# Altium schematic sheet e-VEREST.SchDoc
size A2; Author: Balint Cristian; DrawnBy: Balint Cristian; SheetNumber: 1; SheetTotal: 1
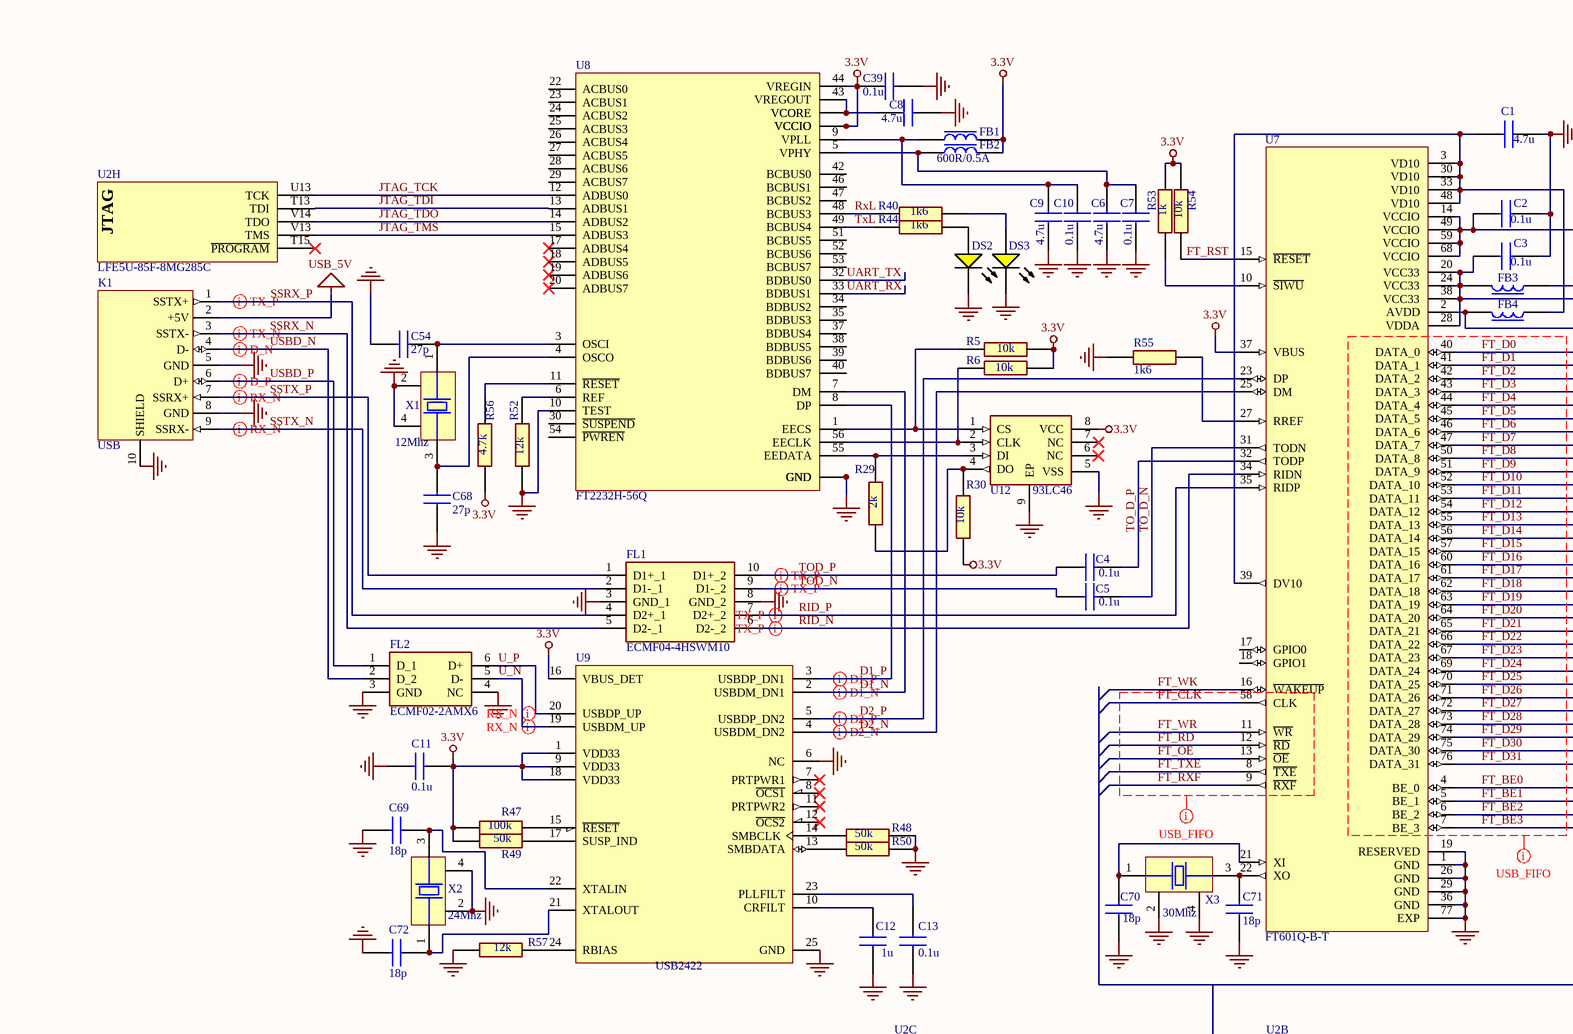
[diagram p0: e-VEREST.SchDoc, top left]
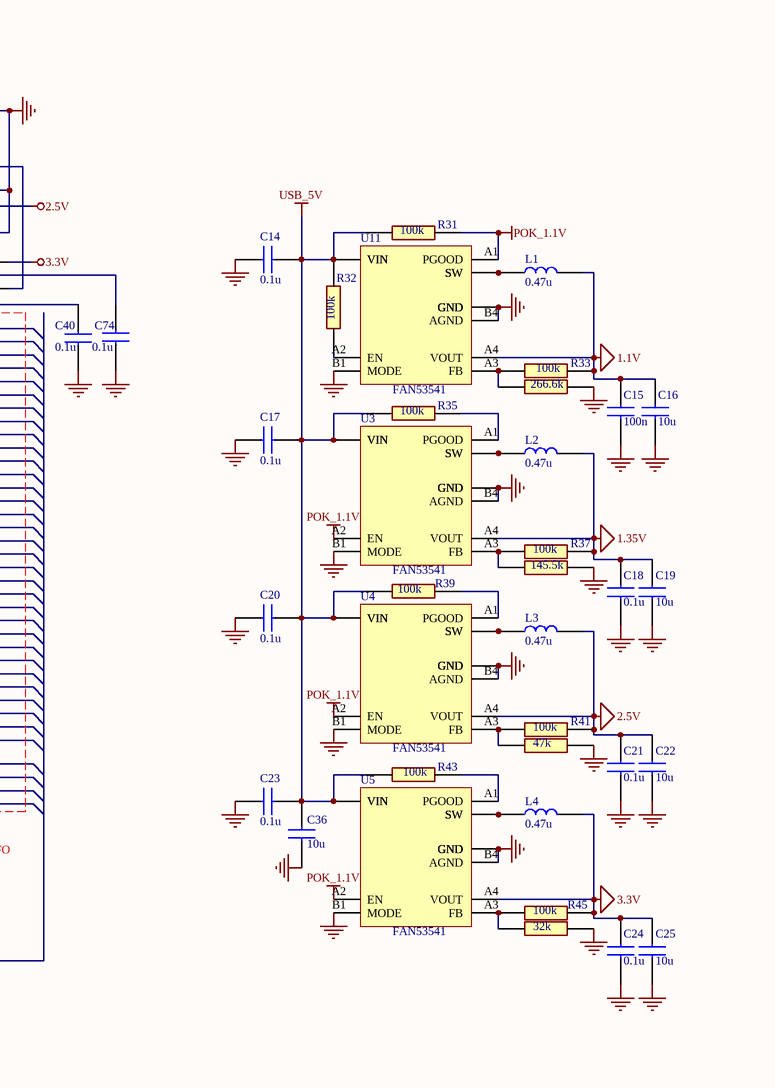
[diagram p1: e-VEREST.SchDoc, top right]
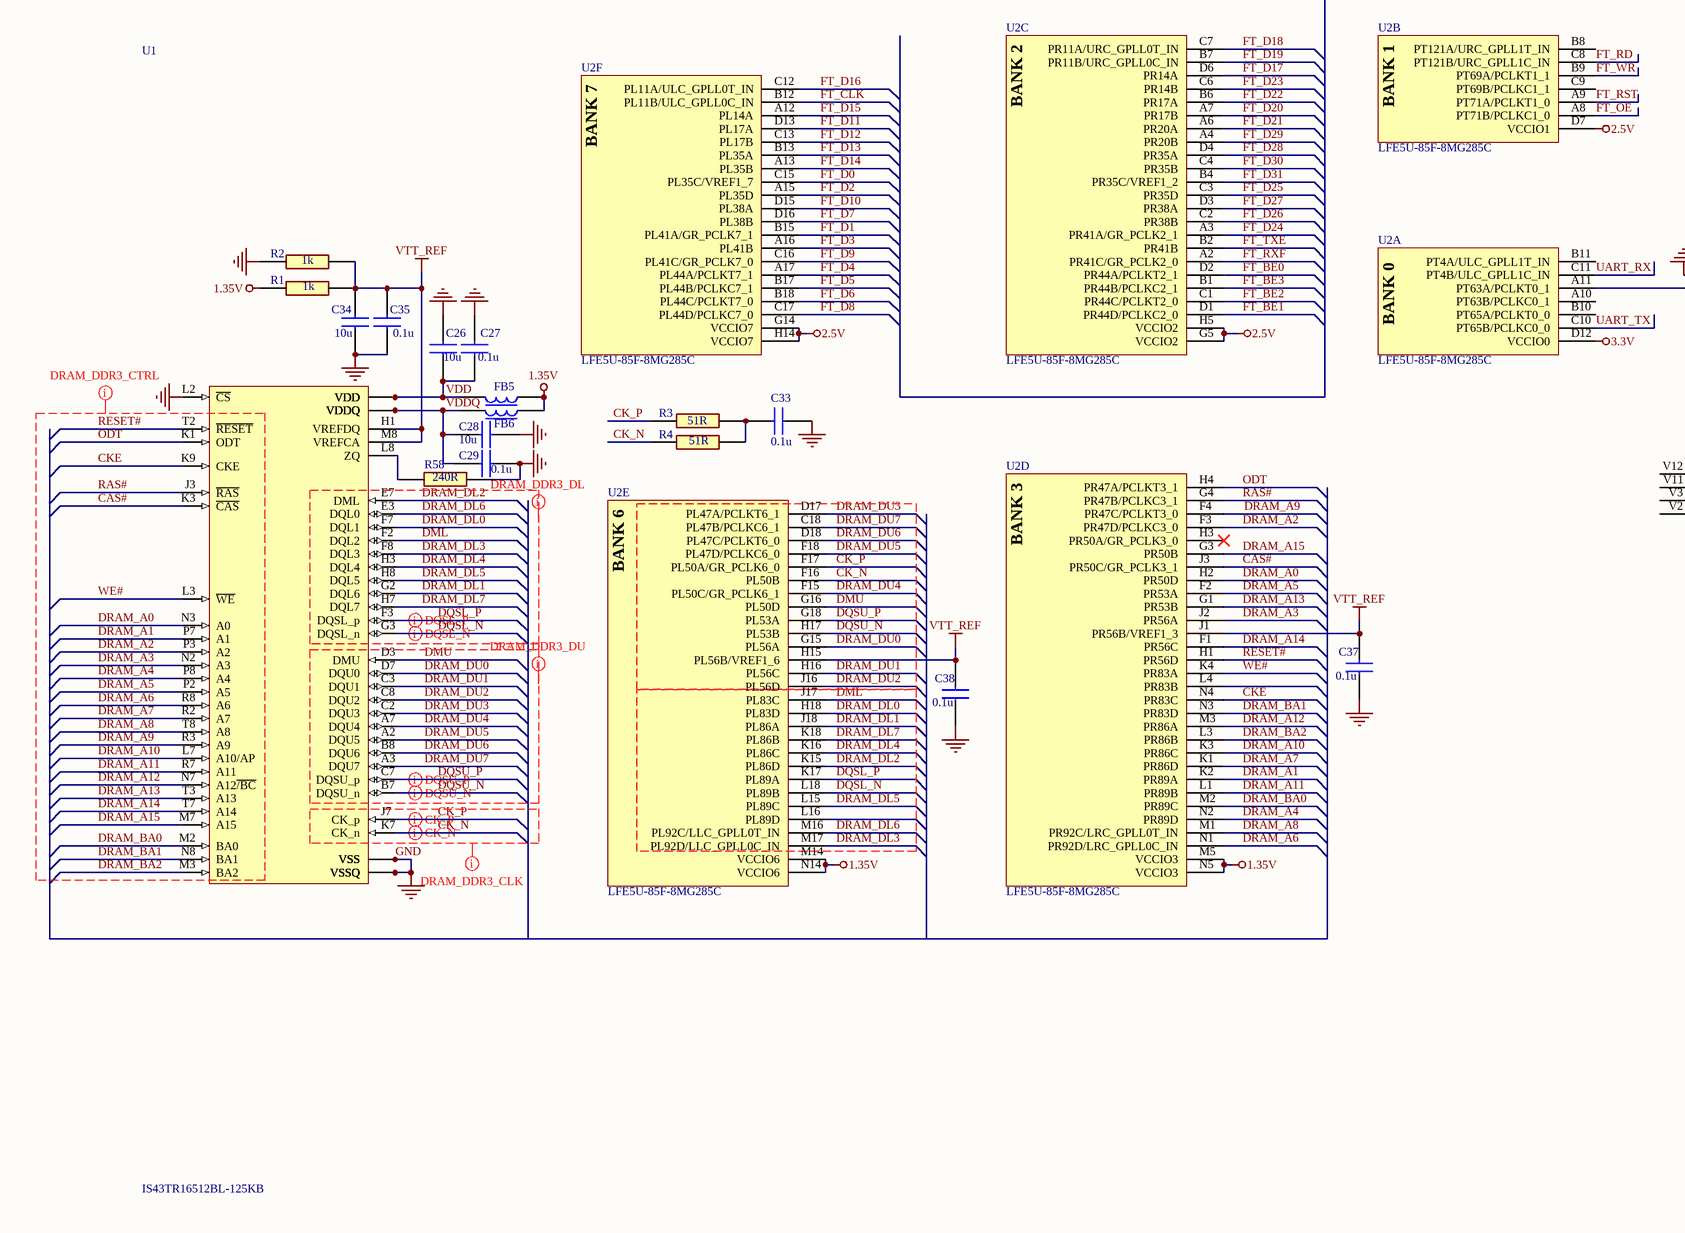
[diagram p2: e-VEREST.SchDoc, bottom left]
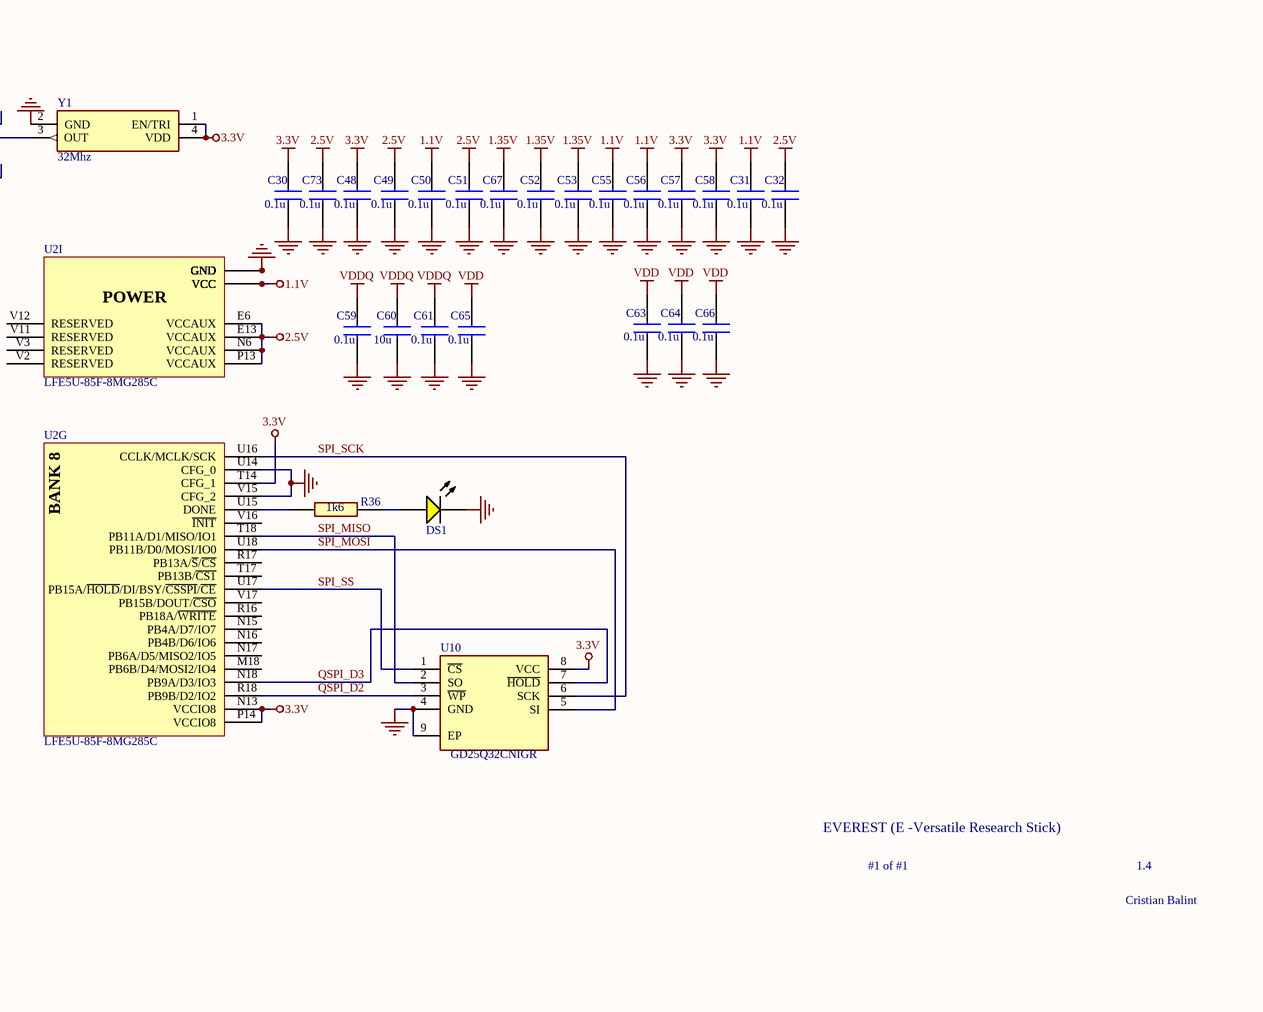
[diagram p3: e-VEREST.SchDoc, bottom right]

## Parts
C1  4.7u  [SMD0201]
C2  0.1u  [SMD0201]
C3  0.1u  [SMD0201]
C4  0.1u  [SMD0201]
C5  0.1u  [SMD0201]
C6  4.7u  [SMD0201]
C7  0.1u  [SMD0201]
C8  4.7u  [SMD0201]
C9  4.7u  [SMD0201]
C10  0.1u  [SMD0201]
C11  0.1u  [SMD0201]
C12  1u  [SMD0201]
C13  0.1u  [SMD0201]
C14  0.1u  [SMD0201]
C15  100n  [SMD0402]
C16  10u  [SMD0402]
C17  0.1u  [SMD0201]
C18  0.1u  [SMD0201]
C19  10u  [SMD0402]
C20  0.1u  [SMD0201]
C21  0.1u  [SMD0201]
C22  10u  [SMD0402]
C23  0.1u  [SMD0201]
C24  0.1u  [SMD0201]
C25  10u  [SMD0402]
C26  10u  [SMD0402]
C27  0.1u  [SMD0402]
C28  10u  [SMD0402]
C29  0.1u  [SMD0402]
C30  0.1u  [SMD0201]
C31  0.1u  [SMD0201]
C32  0.1u  [SMD0402]
C33  0.1u  [SMD0201]
C34  10u  [SMD0402]
C35  0.1u  [SMD0402]
C36  10u  [SMD0402]
C37  0.1u  [SMD0201]
C38  0.1u  [SMD0402]
C39  0.1u  [SMD0201]
C40  0.1u  [SMD0402]
C48  0.1u  [SMD0201]
C49  0.1u  [SMD0201]
C50  0.1u  [SMD0402]
C51  0.1u  [SMD0201]
C52  0.1u  [SMD0201]
C53  0.1u  [SMD0201]
C54  27p  [SMD0201]
C55  0.1u  [SMD0201]
C56  0.1u  [SMD0201]
C57  0.1u  [SMD0201]
C58  0.1u  [SMD0201]
C59  0.1u  [SMD0402]
C60  10u  [SMD0402]
C61  0.1u  [SMD0402]
C63  0.1u  [SMD0201]
C64  0.1u  [SMD0402]
C65  0.1u  [SMD0402]
C66  0.1u  [SMD0402]
C67  0.1u  [SMD0201]
C68  27p  [SMD0201]
C69  18p  [SMD0201]
C70  18p  [SMD0402]
C71  18p  [SMD0402]
C72  18p  [SMD0201]
C73  0.1u  [SMD0201]
C74  0.1u  [SMD0201]
DS1  LED 0603  [LED0603]  (value not drawn)
DS2  LED 0603  [LED0603]  (value not drawn)
DS3  LED 0603  [LED0603]  (value not drawn)
FB1  600R/0.5A  [SMD0402]  (value not drawn)
FB2  600R/0.5A  [SMD0402]
FB3  600R/0.5A  [SMD0402]  (value not drawn)
FB4  600R/0.5A  [SMD0402]  (value not drawn)
FB5  600R/0.5A  [SMD0402]  (value not drawn)
FB6  600R/0.5A  [SMD0402]  (value not drawn)
FL1  ECMF04-4HSWM10  [SON50P135X260X55-10N-D]
FL2  ECMF02-2AMX6  [SON50P150X170X55-6N-D]
K1  USB  [USB-TYPE-A-3.0]
L1  0.47u  [SMD0805]
L2  0.47u  [SMD0805]
L3  0.47u  [SMD0805]
L4  0.47u  [SMD0805]
R1  1k  [SMD0402]
R2  1k  [SMD0402]
R3  51R  [SMD0201]
R4  51R  [SMD0201]
R5  10k  [SMD0201]
R6  10k  [SMD0201]
R29  2k  [SMD0201]
R30  10k  [SMD0201]
R31  100k  [SMD0201]
R32  100k  [SMD0201]
R33  100k  [SMD0201]
R34  266.6k  [SMD0201]
R35  100k  [SMD0201]
R36  1k6  [SMD0201]
R37  100k  [SMD0201]
R38  145.5k  [SMD0201]
R39  100k  [SMD0201]
R40  1k6  [SMD0201]
R41  100k  [SMD0201]
R42  47k  [SMD0201]
R43  100k  [SMD0201]
R44  1k6  [SMD0201]
R45  100k  [SMD0201]
R46  32k  [SMD0201]
R47  100k  [SMD0201]
R48  50k  [SMD0201]
R49  50k  [SMD0201]
R50  50k  [SMD0201]
R52  12k  [SMD0201]
R53  1k  [SMD0201]
R54  10k  [SMD0201]
R55  1k6  [SMD0201]
R56  4.7k  [SMD0201]
R57  12k  [SMD0201]
R58  240R  [SMD0402]
U1  IS43TR16512BL-125KB  [*BGA96C80P9X16_1000X1400X140N_IS43TR16512AL-125KBL(Primary)]
U2  LFE5U-85F-8MG285C  [*BGA285N50P18X18_1000X1000X130]  (parts A,B,C,D,E,F,G,H,I of 9)
U3  FAN53541  [WLCSP20P4X5]
U4  FAN53541  [WLCSP20P4X5]
U5  FAN53541  [WLCSP20P4X5]
U7  FT601Q-B-T  [FT601Q]
U8  FT2232H-56Q  [QFN50P800X800X100-57N-D]
U9  USB2422  [QFN-MJ24]
U10  GD25Q32CNIGR  [*SON50P300X400X100-9N]
U11  FAN53541  [WLCSP20P4X5]
U12  93LC46  [*SON50P200X300X100-9N]
X1  12Mhz  [CRYSTAL2520]
X2  24Mhz  [CRYSTAL1210]
X3  30Mhz  [CRYSTAL1210]
Y1  32Mhz  [TY]

## Nets
1.1V: C15.2 C16.2 C31.1 C50.1 C55.1 C56.1 L1.2 R33.2 U2.D8(VCC) U2.D9(VCC) U2.D10(VCC) U2.D11(VCC) U2.J4(VCC) U2.J5(VCC) U2.J14(VCC) U2.J15(VCC) U2.M4(VCC) U2.M15(VCC) U2.P7(VCC) U2.P9(VCC) U2.P11(VCC) U11.A4(VOUT)
1.35V: C18.2 C19.2 C52.1 C53.1 C67.1 FB5.1 FB6.1 L2.2 R1.1 R37.2 U2.M5(VCCIO3) U2.M14(VCCIO6) U2.N5(VCCIO3) U2.N14(VCCIO6) U3.A4(VOUT)
2.5V: C2.2 C21.2 C22.2 C32.1 C49.1 C51.1 C73.1 L3.2 R41.2 U2.D7(VCCIO1) U2.E6(VCCAUX) U2.E13(VCCAUX) U2.G5(VCCIO2) U2.G14(VCCIO7) U2.H5(VCCIO2) U2.H14(VCCIO7) U2.N6(VCCAUX) U2.P13(VCCAUX) U4.A4(VOUT) U7.14(VCCIO) U7.49(VCCIO) U7.59(VCCIO) U7.68(VCCIO)
3.3V: C11.1 C24.2 C25.2 C30.1 C39.2 C48.1 C57.1 C58.1 FB1.2 FB2.2 FB3.1 L4.2 R5.2 R6.2 R30.2 R45.2 R47.1 R49.1 R53.1 R54.1 R56.1 U2.D12(VCCIO0) U2.N13(VCCIO8) U2.P14(VCCIO8) U2.T14(CFG_1) U5.A4(VOUT) U7.37(VBUS) U8.16(VCCIO) U8.36(VCCIO) U8.44(VREGIN) U8.50(VCCIO) U9.1(VDD33) U9.9(VDD33) U9.16(VBUS_DET) U9.18(VDD33) U10.8(VCC) U12.8(VCC) Y1.1(EN/TRI) Y1.4(VDD)
GND: C1.1 C2.1 C3.1 C6.1 C7.1 C8.1 C9.1 C10.1 C11.2 C12.2 C13.2 C14.2 C15.1 C16.1 C17.2 C18.1 C19.1 C20.2 C21.1 C22.1 C23.2 C24.1 C25.1 C26.1 C27.1 C28.1 C29.1 C30.2 C31.2 C32.2 C33.1 C34.2 C35.2 C36.1 C37.2 C38.2 C39.1 C40.2 C48.2 C49.2 C50.2 C51.2 C52.2 C53.2 C54.2 C55.2 C56.2 C57.2 C58.2 C59.2 C60.2 C61.2 C63.2 C64.2 C65.2 C66.2 C67.2 C68.1 C69.1 C70.2 C71.2 C72.1 C73.2 C74.1 DS1.2(K) DS2.2(K) DS3.2(K) FL1.3(GND_1) FL1.8(GND_2) FL2.3(GND) FL2.4(NC) K1.5(GND) K1.8(GND) K1.10(SHIELD) R2.1 R34.1 R38.1 R42.1 R46.1 R48.2 R50.2 R52.1 R55.2 R57.1 R58.2 U1.A9(VSS) U1.B1(VSSQ) U1.B3(VSS) U1.B9(VSSQ) U1.D1(VSSQ) U1.D8(VSSQ) U1.E1(VSS) U1.E2(VSSQ) U1.E8(VSSQ) U1.F9(VSSQ) U1.G1(VSSQ) U1.G8(VSS) U1.G9(VSSQ) U1.J2(VSS) U1.J8(VSS) U1.L2(~{CS}) U1.M1(VSS) U1.M9(VSS) U1.P1(VSS) U1.P9(VSS) U1.T1(VSS) U1.T9(VSS) U2.B3(GND) U2.B16(GND) U2.E5(GND) U2.E7(GND) U2.E8(GND) U2.E9(GND) U2.E10(GND) U2.E11(GND) U2.E12(GND) U2.E14(GND) U2.F5(GND) U2.F6(GND) U2.F7(GND) U2.F8(GND) U2.F9(GND) U2.F10(GND) U2.F11(GND) U2.F12(GND) U2.F13(GND) U2.F14(GND) U2.G2(GND) U2.G6(GND) U2.G7(GND) U2.G8(GND) U2.G9(GND) U2.G10(GND) U2.G11(GND) U2.G12(GND) U2.G13(GND) U2.G17(GND) U2.H6(GND) U2.H7(GND) U2.H8(GND) U2.H9(GND) U2.H10(GND) U2.H11(GND) U2.H12(GND) U2.H13(GND) U2.J6(GND) U2.J7(GND) U2.J8(GND) U2.J9(GND) U2.J10(GND) U2.J11(GND) U2.J12(GND) U2.J13(GND) U2.K5(GND) U2.K6(GND) U2.K7(GND) U2.K8(GND) U2.K9(GND) U2.K10(GND) U2.K11(GND) U2.K12(GND) U2.K13(GND) U2.K14(GND) U2.L2(GND) U2.L5(GND) U2.L6(GND) U2.L7(GND) U2.L8(GND) U2.L9(GND) U2.L10(GND) U2.L11(GND) U2.L12(GND) U2.L13(GND) U2.L14(GND) U2.L17(GND) U2.M6(GND) U2.M7(GND) U2.M8(GND) U2.M9(GND) U2.M10(GND) U2.M11(GND) U2.M12(GND) U2.M13(GND) U2.N7(GND) U2.N8(GND) U2.N9(GND) U2.N10(GND) U2.N11(GND) U2.N12(GND) U2.P5(GND) U2.P6(GND) U2.P8(GND) U2.P10(GND) U2.P12(GND) U2.R1(GND) U2.R2(GND) U2.R3(GND) U2.R10(GND) U2.T1(GND) U2.T2(GND) U2.T3(GND) U2.T4(GND) U2.T5(GND) U2.T6(GND) U2.T7(GND) U2.T8(GND) U2.T9(GND) U2.T10(GND) U2.T11(GND) U2.T12(GND) U2.T16(GND) U2.U1(GND) U2.U2(GND) U2.U3(GND) U2.U4(GND) U2.U5(GND) U2.U6(GND) U2.U7(GND) U2.U8(GND) U2.U9(GND) U2.U10(GND) U2.U11(GND) U2.U12(GND) U2.U14(CFG_0) U2.V4(GND) U2.V5(GND) U2.V6(GND) U2.V7(GND) U2.V8(GND) U2.V9(GND) U2.V10(GND) U2.V15(CFG_2) U3.B1(MODE) U3.B2(GND) U3.B3(GND) U3.B4(AGND) U3.C1(GND) U3.C2(GND) U3.C3(GND) U3.C4(GND) U4.B1(MODE) U4.B2(GND) U4.B3(GND) U4.B4(AGND) U4.C1(GND) U4.C2(GND) U4.C3(GND) U4.C4(GND) U5.B1(MODE) U5.B2(GND) U5.B3(GND) U5.B4(AGND) U5.C1(GND) U5.C2(GND) U5.C3(GND) U5.C4(GND) U7.1(GND) U7.19(RESERVED) U7.26(GND) U7.29(GND) U7.36(GND) U7.77(EXP) U8.10(TEST) U8.21(GND) U8.41(GND) U8.45(GND) U8.57(GND) U9.6(NC) U9.25(GND) U10.4(GND) U10.9(EP) U11.B1(MODE) U11.B2(GND) U11.B3(GND) U11.B4(AGND) U11.C1(GND) U11.C2(GND) U11.C3(GND) U11.C4(GND) U12.5(VSS) U12.9(EP) X1.2(GND) X1.4(GND) X2.2(GND) X2.4(GND) X3.2(GND) X3.4(GND) Y1.2(GND)
POK_1.1V: R31.2 U3.A2(EN) U4.A2(EN) U5.A2(EN) U11.A1(PGOOD)
USB_5V: C14.1 C17.1 C20.1 C23.1 C36.2 K1.2(+5V) R31.1 R32.2 R35.1 R39.1 R43.1 U3.D1(VIN) U3.D2(VIN) U3.E1(VIN) U3.E2(VIN) U4.D1(VIN) U4.D2(VIN) U4.E1(VIN) U4.E2(VIN) U5.D1(VIN) U5.D2(VIN) U5.E1(VIN) U5.E2(VIN) U11.D1(VIN) U11.D2(VIN) U11.E1(VIN) U11.E2(VIN)
VDD: C26.2 C27.2 C63.1 C64.1 C65.1 C66.1 FB5.2 U1.B2(VDD) U1.D9(VDD) U1.G7(VDD) U1.K2(VDD) U1.K8(VDD) U1.N1(VDD) U1.N9(VDD) U1.R1(VDD) U1.R9(VDD)
VDDQ: C28.2 C29.2 C59.1 C60.1 C61.1 FB6.2 U1.A1(VDDQ) U1.A8(VDDQ) U1.C1(VDDQ) U1.C9(VDDQ) U1.D2(VDDQ) U1.E9(VDDQ) U1.F1(VDDQ) U1.H2(VDDQ) U1.H9(VDDQ)
VTT_REF: C34.1 C35.1 C37.1 C38.1 R1.2 R2.2 U1.H1(VREFDQ) U1.M8(VREFCA) U2.H15(PL56B/VREF1_6) U2.J1(PR56B/VREF1_3)
CAS#: U1.K3(~{CAS}) U2.J3(PR50C/GR_PCLK3_1)
CK_N: R4.2 U1.K7(CK_n) U2.F16(PL50B)
CK_P: R3.1 U1.J7(CK_p) U2.F17(PL50A/GR_PCLK6_0)
CKE: U1.K9(CKE) U2.N4(PR83C)
D1_N: U8.7(DM) U9.2(USBDM_DN1)
D1_P: U8.8(DP) U9.3(USBDP_DN1)
D2_N: U7.25(DM) U9.4(USBDM_DN2)
D2_P: U7.23(DP) U9.5(USBDP_DN2)
DML: U1.F2(DQL2) U2.J17(PL83C)
DMU: U1.D3(DMU) U2.G16(PL50D)
DQSL_N: U1.G3(DQSL_n) U2.L18(PL89B)
DQSL_P: U1.F3(DQSL_p) U2.K17(PL89A)
DQSU_N: U1.B7(DQSU_n) U2.H17(PL53B)
DQSU_P: U1.C7(DQSU_p) U2.G18(PL53A)
DRAM_A0: U1.N3(A0) U2.H2(PR50D)
DRAM_A1: U1.P7(A1) U2.K2(PR89A)
DRAM_A2: U1.P3(A2) U2.F3(PR47D/PCLKC3_0)
DRAM_A3: U1.N2(A3) U2.J2(PR56A)
DRAM_A4: U1.P8(A4) U2.N2(PR89D)
DRAM_A5: U1.P2(A5) U2.F2(PR53A)
DRAM_A6: U1.R8(A6) U2.N1(PR92D/LRC_GPLL0C_IN)
DRAM_A7: U1.R2(A7) U2.K1(PR86D)
DRAM_A8: U1.T8(A8) U2.M1(PR92C/LRC_GPLL0T_IN)
DRAM_A9: U1.R3(A9) U2.F4(PR47C/PCLKT3_0)
DRAM_A10: U1.L7(A10/AP) U2.K3(PR86C)
DRAM_A11: U1.R7(A11) U2.L1(PR89B)
DRAM_A12: U1.N7(A12~{/BC}) U2.M3(PR86A)
DRAM_A13: U1.T3(A13) U2.G1(PR53B)
DRAM_A14: U1.T7(A14) U2.F1(PR56C)
DRAM_A15: U1.M7(A15) U2.G3(PR50B)
DRAM_BA0: U1.M2(BA0) U2.M2(PR89C)
DRAM_BA1: U1.N8(BA1) U2.N3(PR83D)
DRAM_BA2: U1.M3(BA2) U2.L3(PR86B)
DRAM_DL0: U1.F7(DQL1) U2.H18(PL83D)
DRAM_DL1: U1.G2(DQL6) U2.J18(PL86A)
DRAM_DL2: U1.E7(DML) U2.K15(PL86D)
DRAM_DL3: U1.F8(DQL3) U2.M17(PL92D/LLC_GPLL0C_IN)
DRAM_DL4: U1.H3(DQL4) U2.K16(PL86C)
DRAM_DL5: U1.H8(DQL5) U2.L15(PL89C)
DRAM_DL6: U1.E3(DQL0) U2.M16(PL92C/LLC_GPLL0T_IN)
DRAM_DL7: U1.H7(DQL7) U2.K18(PL86B)
DRAM_DU0: U1.D7(DQU0) U2.G15(PL56A)
DRAM_DU1: U1.C3(DQU1) U2.H16(PL56C)
DRAM_DU2: U1.C8(DQU2) U2.J16(PL56D)
DRAM_DU3: U1.C2(DQU3) U2.D17(PL47A/PCLKT6_1)
DRAM_DU4: U1.A7(DQU4) U2.F15(PL50C/GR_PCLK6_1)
DRAM_DU5: U1.A2(DQU5) U2.F18(PL47D/PCLKC6_0)
DRAM_DU6: U1.B8(DQU6) U2.D18(PL47C/PCLKT6_0)
DRAM_DU7: U1.A3(DQU7) U2.C18(PL47B/PCLKC6_1)
FT_BE0: U2.D2(PR44A/PCLKT2_1) U7.4(BE_0)
FT_BE1: U2.D1(PR44D/PCLKC2_0) U7.5(BE_1)
FT_BE2: U2.C1(PR44C/PCLKT2_0) U7.6(BE_2)
FT_BE3: U2.B1(PR44B/PCLKC2_1) U7.7(BE_3)
FT_CLK: U2.B12(PL11B/ULC_GPLL0C_IN) U7.58(CLK)
FT_D0: U2.C15(PL35C/VREF1_7) U7.40(DATA_0)
FT_D1: U2.B15(PL41A/GR_PCLK7_1) U7.41(DATA_1)
FT_D2: U2.A15(PL35D) U7.42(DATA_2)
FT_D3: U2.A16(PL41B) U7.43(DATA_3)
FT_D4: U2.A17(PL44A/PCLKT7_1) U7.44(DATA_4)
FT_D5: U2.B17(PL44B/PCLKC7_1) U7.45(DATA_5)
FT_D6: U2.B18(PL44C/PCLKT7_0) U7.46(DATA_6)
FT_D7: U2.D16(PL38B) U7.47(DATA_7)
FT_D8: U2.C17(PL44D/PCLKC7_0) U7.50(DATA_8)
FT_D9: U2.C16(PL41C/GR_PCLK7_0) U7.51(DATA_9)
FT_D10: U2.D15(PL38A) U7.52(DATA_10)
FT_D11: U2.D13(PL17A) U7.53(DATA_11)
FT_D12: U2.C13(PL17B) U7.54(DATA_12)
FT_D13: U2.B13(PL35A) U7.55(DATA_13)
FT_D14: U2.A13(PL35B) U7.56(DATA_14)
FT_D15: U2.A12(PL14A) U7.57(DATA_15)
FT_D16: U2.C12(PL11A/ULC_GPLL0T_IN) U7.60(DATA_16)
FT_D17: U2.D6(PR14A) U7.61(DATA_17)
FT_D18: U2.C7(PR11A/URC_GPLL0T_IN) U7.62(DATA_18)
FT_D19: U2.B7(PR11B/URC_GPLL0C_IN) U7.63(DATA_19)
FT_D20: U2.A7(PR17B) U7.64(DATA_20)
FT_D21: U2.A6(PR20A) U7.65(DATA_21)
FT_D22: U2.B6(PR17A) U7.66(DATA_22)
FT_D23: U2.C6(PR14B) U7.67(DATA_23)
FT_D24: U2.A3(PR41A/GR_PCLK2_1) U7.69(DATA_24)
FT_D25: U2.C3(PR35D) U7.70(DATA_25)
FT_D26: U2.C2(PR38B) U7.71(DATA_26)
FT_D27: U2.D3(PR38A) U7.72(DATA_27)
FT_D28: U2.D4(PR35A) U7.73(DATA_28)
FT_D29: U2.A4(PR20B) U7.74(DATA_29)
FT_D30: U2.C4(PR35B) U7.75(DATA_30)
FT_D31: U2.B4(PR35C/VREF1_2) U7.76(DATA_31)
FT_OE: U2.A8(PT71B/PCLKC1_0) U7.13(~{OE})
FT_RD: U2.C8(PT121B/URC_GPLL1C_IN) U7.12(~{RD})
FT_RST: R54.2 U2.A9(PT71A/PCLKT1_0) U7.15(~{RESET})
FT_RXF: U2.A2(PR41C/GR_PCLK2_0) U7.9(~{RXF})
FT_TXE: U2.B2(PR41B) U7.8(~{TXE})
FT_WK: U7.16(~{WAKEUP})
FT_WR: U2.B9(PT69A/PCLKT1_1) U7.11(~{WR})
JTAG_TCK: U2.U13(TCK) U8.12(ADBUS0)
JTAG_TDI: U2.T13(TDI) U8.13(ADBUS1)
JTAG_TDO: U2.V14(TDO) U8.14(ADBUS2)
JTAG_TMS: U2.V13(TMS) U8.15(ADBUS3)
ODT: U1.K1(ODT) U2.H4(PR47A/PCLKT3_1)
QSPI_D2: U2.R18(PB9B/D2/IO2) U10.3(~{WP})
QSPI_D3: U2.N18(PB9A/D3/IO3) U10.7(~{HOLD})
RAS#: U1.J3(~{RAS}) U2.G4(PR47B/PCLKC3_1)
RESET#: U1.T2(~{RESET}) U2.H1(PR56D)
RID_N: FL1.6(D2-_2) U7.34(RIDN)
RID_P: FL1.7(D2+_2) U7.35(RIDP)
RxL: R40.2 U8.48(BCBUS3)
SPI_MISO: U2.T18(PB11A/D1/MISO/IO1) U10.2(SO)
SPI_MOSI: U2.U18(PB11B/D0/MOSI/IO0) U10.5(SI)
SPI_SCK: U2.U16(CCLK/MCLK/SCK) U10.6(SCK)
SPI_SS: U2.U17(PB15A/~{HOLD}/DI/BSY/~{CSSPI}/~{CE}) U10.1(~{CS})
SSRX_N: FL1.5(D2-_1) K1.3(SSTX-)
SSRX_P: FL1.4(D2+_1) K1.1(SSTX+)
SSTX_N: FL1.2(D1-_1) K1.9(SSRX-)
SSTX_P: FL1.1(D1+_1) K1.7(SSRX+)
TO_D_N: C5.2 U7.31(TODN)
TO_D_P: C4.2 U7.32(TODP)
TOD_N: C5.1 FL1.9(D1-_2)
TOD_P: C4.1 FL1.10(D1+_2)
TxL: R44.2 U8.49(BCBUS4)
U_N: FL2.5(D-) U9.19(USBDM_UP)
U_P: FL2.6(D+) U9.20(USBDP_UP)
UART_RX: U2.C11(PT4B/ULC_GPLL1C_IN) U8.33(BDBUS1)
UART_TX: U2.C10(PT65B/PCLKC0_0) U8.32(BDBUS0)
USBD_N: FL2.2(D_2) K1.4(D-)
USBD_P: FL2.1(D_1) K1.6(D+)
WE#: U1.L3(~{WE}) U2.K4(PR83A)
NetC1_2: C1.2 FB4.1 U7.3(VD10) U7.30(VD10) U7.33(VD10) U7.39(DV10) U7.48(VD10)
NetC3_2: C3.2 C74.2 FB3.2 U7.20(VCC33) U7.24(VCC33) U7.28(VDDA) U7.38(VCC33)
NetC6_2: C6.2 C7.2 FB2.1 U8.5(VPHY)
NetC8_2: C8.2 U8.2(VCORE) U8.31(VCORE) U8.43(VREGOUT)
NetC9_2: C9.2 C10.2 FB1.1 U8.9(VPLL)
NetC12_1: C12.1 U9.10(CRFILT)
NetC13_1: C13.1 U9.23(PLLFILT)
NetC33_2: C33.2 R3.2 R4.1
NetC40_1: C40.1 FB4.2 U7.2(AVDD)
NetC54_1: C54.1 U8.3(OSCI) X1.1(X1)
NetC68_2: C68.2 U8.4(OSCO) X1.3(X2)
NetC69_2: C69.2 U9.22(XTALIN) X2.3(X2)
NetC70_1: C70.1 U7.21(XI) X3.1(X1)
NetC71_1: C71.1 U7.22(XO) X3.3(X2)
NetC72_2: C72.2 U9.21(XTALOUT) X2.1(X1)
NetDS1_1: DS1.1(A) R36.1
NetDS2_1: DS2.1(A) R44.1
NetDS3_1: DS3.1(A) R40.1
NetL1_1: L1.1 U11.D3(SW) U11.D4(SW) U11.E3(SW) U11.E4(SW)
NetL2_1: L2.1 U3.D3(SW) U3.D4(SW) U3.E3(SW) U3.E4(SW)
NetL3_1: L3.1 U4.D3(SW) U4.D4(SW) U4.E3(SW) U4.E4(SW)
NetL4_1: L4.1 U5.D3(SW) U5.D4(SW) U5.E3(SW) U5.E4(SW)
NetR5_1: R5.1 U8.1(EECS) U12.1(CS)
NetR6_1: R6.1 U8.56(EECLK) U12.2(CLK)
NetR29_1: R29.1 U8.55(EEDATA) U12.3(DI)
NetR29_2: R29.2 R30.1 U12.4(DO)
NetR32_1: R32.1 U11.A2(EN)
NetR33_1: R33.1 R34.2 U11.A3(FB)
NetR35_2: R35.2 U3.A1(PGOOD)
NetR36_2: R36.2 U2.U15(DONE)
NetR37_1: R37.1 R38.2 U3.A3(FB)
NetR39_2: R39.2 U4.A1(PGOOD)
NetR41_1: R41.1 R42.2 U4.A3(FB)
NetR43_2: R43.2 U5.A1(PGOOD)
NetR45_1: R45.1 R46.2 U5.A3(FB)
NetR47_2: R47.2 U9.15(~{RESET})
NetR48_1: R48.1 U9.14(SMBCLK)
NetR49_2: R49.2 U9.17(SUSP_IND)
NetR50_1: R50.1 U9.13(SMBDATA)
NetR52_2: R52.2 U8.6(REF)
NetR53_2: R53.2 U7.10(~{SIWU})
NetR55_1: R55.1 U7.27(RREF)
NetR56_2: R56.2 U8.11(~{RESET})
NetR57_2: R57.2 U9.24(RBIAS)
NetR58_1: R58.1 U1.L8(ZQ)
NetU2_A11: U2.A11(PT63A/PCLKT0_1) Y1.3(OUT)

Not connected (* = marked no-connect by the designer): U1 J1(NC) J9(NC) L1(NC) L9(NC); U2 A10(PT63B/PCLKC0_1) B8(PT121A/URC_GPLL1T_IN) B10(PT65A/PCLKT0_0) B11(PT4A/ULC_GPLL1T_IN) C9(PT69B/PCLKC1_1) H3(PR50A/GR_PCLK3_0)* L4(PR83B) L16(PL89D) M18(PB6B/D4/MOSI2/IO4) N15(PB4A/D7/IO7) N16(PB4B/D6/IO6) N17(PB6A/D5/MISO2/IO5) R16(PB18A/~{WRITE}) R17(PB13A/~{S}/~{CS}) T15(~{PROGRAM})* T17(PB13B/~{CS1}) V2(RESERVED) V3(RESERVED) V11(RESERVED) V12(RESERVED) V16(~{INIT}) V17(PB15B/DOUT/~{CSO}); U7 17(GPIO0) 18(GPIO1); U8 17(ADBUS4)* 18(ADBUS5)* 19(ADBUS6)* 20(ADBUS7)* 22(ACBUS0) 23(ACBUS1) 24(ACBUS2) 25(ACBUS3) 26(ACBUS4) 27(ACBUS5) 28(ACBUS6) 29(ACBUS7) 30(~{SUSPEND}) 34(BDBUS2) 35(BDBUS3) 37(BDBUS4) 38(BDBUS5) 39(BDBUS6) 40(BDBUS7) 42(BCBUS0) 46(BCBUS1) 47(BCBUS2) 51(BCBUS5) 52(BCBUS6) 53(BCBUS7) 54(~{PWREN}); U9 7(PRTPWR1)* 8(~{OCS1})* 11(PRTPWR2)* 12(~{OCS2})*; U12 6(NC)* 7(NC)*

## Layout directives
differential pair: CK_N, CK_P, D1_N, D1_P, D2_N, D2_P, DQSL_N, DQSL_P, DQSU_N, DQSU_P, RID_N, RID_P, SSRX_N, SSRX_P, SSTX_N, SSTX_P, TOD_N, TOD_P, U_N, U_P, USBD_N, USBD_P
net class DRAM_DDR3_CTRL: CAS#, CKE, DRAM_A0, DRAM_A1, DRAM_A2, DRAM_A3, DRAM_A4, DRAM_A5, DRAM_A6, DRAM_A7, DRAM_A8, DRAM_A9, DRAM_A10, DRAM_A11, DRAM_A12, DRAM_A13, DRAM_A14, DRAM_A15, DRAM_BA0, DRAM_BA1, DRAM_BA2, ODT, RAS#, RESET#, WE#
net class USB_FIFO: FT_BE0, FT_BE1, FT_BE2, FT_BE3, FT_CLK, FT_D0, FT_D1, FT_D2, FT_D3, FT_D4, FT_D5, FT_D6, FT_D7, FT_D8, FT_D9, FT_D10, FT_D11, FT_D12, FT_D13, FT_D14, FT_D15, FT_D16, FT_D17, FT_D18, FT_D19, FT_D20, FT_D21, FT_D22, FT_D23, FT_D24, FT_D25, FT_D26, FT_D27, FT_D28, FT_D29, FT_D30, FT_D31, FT_OE, FT_RD, FT_RXF, FT_TXE, FT_WR
net class DRAM_DDR3_DL: DML, DQSL_N, DQSL_P, DRAM_DL0, DRAM_DL1, DRAM_DL2, DRAM_DL3, DRAM_DL4, DRAM_DL5, DRAM_DL6, DRAM_DL7
net class DRAM_DDR3_DU: DMU, DQSU_N, DQSU_P, DRAM_DU0, DRAM_DU1, DRAM_DU2, DRAM_DU3, DRAM_DU4, DRAM_DU5, DRAM_DU6, DRAM_DU7
net class DRAM_DDR3_CLK: CK_N, CK_P

## Notes on the sheet
- EVEREST (E -Versatile Research Stick)
- #1 of #1
- Cristian Balint
- 1.4
- (in symbol LFE5U-85F-8MG285C, part A) BANK 0
- (in symbol LFE5U-85F-8MG285C, part B) BANK 1
- (in symbol LFE5U-85F-8MG285C, part C) BANK 2
- (in symbol LFE5U-85F-8MG285C, part D) BANK 3
- (in symbol LFE5U-85F-8MG285C, part E) BANK 6
- (in symbol LFE5U-85F-8MG285C, part F) BANK 7
- (in symbol LFE5U-85F-8MG285C, part G) BANK 8
- (in symbol LFE5U-85F-8MG285C, part H) JTAG
- (in symbol LFE5U-85F-8MG285C, part I) POWER

## Library data of the parts
C1-C25 C30 C31 C33 C37 C39 C48 C49 C51-C58 C63 C67-C69 C72-C74 = CAP 0201: Capacitor
C26-C29 C32 C34-C36 C38 C40 C50 C59-C61 C64-C66 C70 C71 = CAP 0402: Capacitor
DS1-DS3 = LED 0603: LED 0603 SMD
FB1-FB6 = FERRITE 0402: Ferrite Bead
FL1 = ECMF04-4HSWM10: Filter; Manufacturer_Name: STMicroelectronics; Datasheet Link: https://www.st.com/resource/en/datasheet/ecmf04-4hswm10.pdf; Height: 0.55mm; Manufacturer_Part_Number: ECMF04-4HSWM10; Arrow Part Number: ECMF04-4HSWM10; Arrow Price/Stock: https://www.arrow.com/en/products/ecmf04-4hswm10/stmicroelectronics; Mouser Part Number: 511-ECMF04-4HSWM10; Mouser Price/Stock: https://www.mouser.co.uk/ProductDetail/STMicroelectronics/ECMF04-4HSWM10?qs=9MuLHSklicqPUQRNi%252Bx1Sg%3D%3D
FL2 = ECMF02-2AMX6: Integrated Circuit; Manufacturer_Name: STMicroelectronics; Datasheet Link: http://www.st.com/content/ccc/resource/technical/document/datasheet/3a/28/cf/d0/31/63/48/8c/CD00282307.pdf/files/CD00282307.pdf/jcr:content/translations/en.CD00282307.pdf; Height: 0.55mm; Manufacturer_Part_Number: ECMF02-2AMX6; Arrow Part Number: ECMF02-2AMX6; Arrow Price/Stock: https://www.arrow.com/en/products/ecmf02-2amx6/stmicroelectronics; Mouser Part Number: 511-ECMF02-2AMX6; Mouser Price/Stock: https://www.mouser.co.uk/ProductDetail/STMicroelectronics/ECMF02-2AMX6?qs=raAh8RbVwI65u5gmT42%2Flg%3D%3D
K1 = USB-TYPE-A-3.0: Conn USB 3.0 Type A; Manufacturer Part Number: 0480370001
L1-L4 = INDUCTOR SMD: Inductor
R1 R2 R58 = RES 0402: Resistor; Height: 0.28mm
R3-R6 R29-R50 R52-R57 = RES 0201: Resistor; Height: 0.28mm
U1 = IS43TR16512BL-125KB: DRAM Chip DDR3L SDRAM 8G-Bit 512Mx16 1.35V 96-Pin LF-BGA
U7 = FT601Q-B-T: USB Bridge, USB to FIFO USB 3.0 FIFO Interface 76-QFN _9x9_; MF: FTDI, Future; Package: QFN-76 FTDI; MP: FT601Q-B-T
U8 = FT2232H-56Q: Integrated Circuit
U9 = USB2422: Microchip Technology USB2422/MJ, USB Controller, USB 2.0, 3.3 V, 24-Pin SQFN; Operating Temperature: 0.00 °C (min); Packaging: Tray
U10 = AT25SF081-MAHD-T: Integrated Circuit
U12 = 93LC46BT-I_MC
X1 = CRYSTAL2520: Crystal 2.5mm x 2.0mm
X2 X3 = CRYSTAL1210: Crystal 1.2mm x 1.0mm
Y1 = MEMS-32Mhz: Crystal or Oscillator